# Altium schematic sheet power-eth.SchDoc
size Letter; CompanyName: Signal Laboratories, Inc.; Address1: 3479 Edison Way; Address2: Menlo Park CA 94025; Address3: +1 (877) 778-8435; Address4: siglabs.com; Revision: 1; SheetNumber: 33; SheetTotal: 53
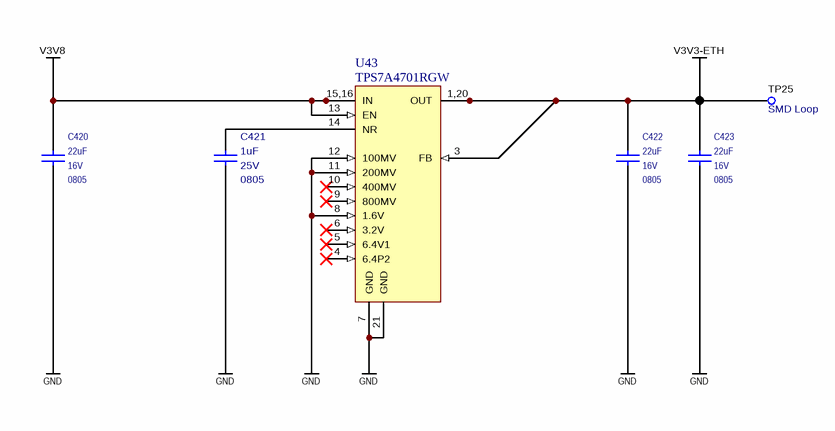
[diagram p0: power-eth.SchDoc]

## Parts
C420  value 22uF  Voltage: 16V  Package: 0805  [CAPC200X125X145L45N]  (hidden comment: CL21A226KOQNNNE)
C421  value 1uF  Package: 0805  Voltage: 25V  [CAPC160X80X90L20N]  (hidden comment: TMK212B7105KG)
C422  value 22uF  Voltage: 16V  Package: 0805  [CAPC200X125X145L45N]  (hidden comment: CL21A226KOQNNNE)
C423  value 22uF  Voltage: 16V  Package: 0805  [CAPC200X125X145L45N]  (hidden comment: CL21A226KOQNNNE)
TP25  Notes: SMD Loop  [5015]  (hidden comment: 5015)
U43  TPS7A4701RGW  [QFN65P500X500X100-21N]

## Nets
GND: C420.1 C421.2 C422.1 C423.1 U43.7(GND) U43.8(1.6V) U43.11(200MV) U43.12(100MV) U43.21(GND)
V3V3-ETH: C422.2 C423.2 TP25.1 U43.1(OUT) U43.3(FB) U43.20(OUT)
V3V8: C420.2 U43.13(EN) U43.15(IN) U43.16(IN)
NetC421_1: C421.1 U43.14(NR)

Not connected (* = marked no-connect by the designer): U43 4(6.4P2)* 5(6.4V1)* 6(3.2V)* 9(800MV)* 10(400MV)*

## Notes on the sheet
- Title
- Engineer
- Revision
- Drawn By
- Checked By
- Date
- Sheet
- of
- (in symbol TPS7A4701RGW_1) 15,16; 1,20

## Library data of the parts
C420 C422 C423 = CAP 0603: Ceramic Capacitor 22uF ±20% 16V X5R 0805; Manufacturer: Samsung Electro-Mechanics; Tr: -55:85; Manufacturer P/N: CL21A226KOQNNNE; Tolerance: ±20%
C421 = TMK212B7105KG: Ceramic Capacitor 1uF ±10% 25V X7R 0805; Manufacturer: Taiyo Yuden; pF: 1000000; Manufacturer P/N: TMK212B7105KG; Tolerance: ±10%; Tr: *
TP25 = TEST_POINT_SMD_50: Test Point SMD; Manufacturer: Keystone; Manufacturer P/N: 5015
U43 = TPS7A4701RGW_1: Low-Dropout Linear Regulator 20-VQFN; Manufacturer: Texas Instruments; Manufacturer P/N: TPS7A4701RGW; Package: VQFN-20